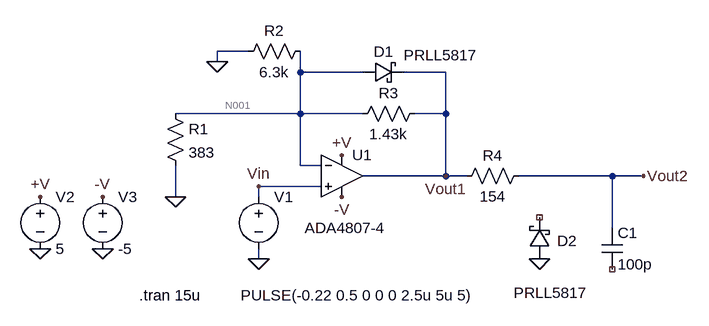
[diagram p0: schematic Draft9.asc]
Draft9.asc, the LTspice schematic file:
Version 4
SHEET 1 880 680
WIRE 32 -32 -16 -32
WIRE -16 -16 -16 -32
WIRE 112 0 112 -32
WIRE 208 0 112 0
WIRE 336 0 272 0
WIRE 112 64 112 0
WIRE 112 64 -80 64
WIRE 208 64 112 64
WIRE 336 64 336 0
WIRE 336 64 288 64
WIRE 112 144 112 64
WIRE 144 144 112 144
WIRE 336 160 336 64
WIRE 336 160 208 160
WIRE 368 160 336 160
WIRE 592 160 448 160
WIRE 640 160 592 160
WIRE 144 176 48 176
WIRE -80 192 -80 144
WIRE 48 192 48 176
WIRE 592 240 592 160
WIRE 48 288 48 272
FLAG -16 -16 0
FLAG 48 288 0
FLAG 176 128 +V
FLAG 176 192 -V
FLAG -288 192 +V
FLAG -192 192 -V
FLAG 480 288 0
FLAG 48 176 Vin
FLAG 336 160 Vout1
FLAG 640 160 Vout2
FLAG -80 192 0
FLAG -192 272 0
FLAG -288 272 0
SYMBOL OpAmps\\ADA4807-4 176 96 R0
WINDOW 3 -57 144 Left 2
SYMATTR InstName U1
SYMBOL res 128 -48 R90
WINDOW 0 0 56 VBottom 2
WINDOW 3 32 56 VTop 2
SYMATTR InstName R2
SYMATTR Value 6.3k
SYMBOL schottky 208 16 R270
WINDOW 0 32 32 VTop 2
WINDOW 3 58 120 VBottom 2
SYMATTR InstName D1
SYMATTR Value PRLL5817
SYMATTR Description Diode
SYMATTR Type diode
SYMBOL res 304 48 R90
WINDOW 0 0 56 VBottom 2
WINDOW 3 32 56 VTop 2
SYMATTR InstName R3
SYMATTR Value 1.43k
SYMBOL voltage 48 176 R0
WINDOW 123 0 0 Left 0
WINDOW 39 0 0 Left 0
WINDOW 3 -28 168 Left 2
SYMATTR Value PULSE(-0.22 0.5 0 0 0 2.5u 5u 5)
SYMATTR InstName V1
SYMBOL voltage -288 176 R0
SYMATTR InstName V2
SYMATTR Value 5
SYMBOL voltage -192 176 R0
SYMATTR InstName V3
SYMATTR Value -5
SYMBOL schottky 496 288 R180
WINDOW 0 -42 28 Left 2
WINDOW 3 -58 -52 Left 2
SYMATTR InstName D2
SYMATTR Value PRLL5817
SYMATTR Description Diode
SYMATTR Type diode
SYMBOL cap 576 240 R0
SYMATTR InstName C1
SYMATTR Value 100p
SYMBOL res -96 48 R0
SYMATTR InstName R1
SYMATTR Value 383
SYMBOL res 464 144 R90
WINDOW 0 0 56 VBottom 2
WINDOW 3 32 56 VTop 2
SYMATTR InstName R4
SYMATTR Value 154
TEXT -136 344 Left 2 !.tran 15u

The netlist it stands for:
* Draft9.asc
XU1 Vin N001 +V -V Vout1 ADA4807-4  ; pins In+ In- V+ V- OUT
R2 N001 0 6.3k
D1 N001 Vout1 PRLL5817
R3 Vout1 N001 1.43k
V1 Vin 0 PULSE(-0.22 0.5 0 0 0 2.5u 5u 5)
V2 +V 0 5
V3 -V 0 -5
D2 0 NC_01 PRLL5817
C1 Vout2 NC_02 100p
R1 N001 0 383
R4 Vout2 Vout1 154
.model D D
.lib standard.dio
.tran 15u
.backanno
.end

* Results of the author's LTspice run, read from the files saved beside the schematic
* Operating Point, zero values left out:
*   V(+v) = 5 V
*   V(-v) = -5 V
*   V(n001) = -220 mV
*   V(vin) = -220 mV
*   V(vout1) = -364.8 mV
*   V(vout2) = -364.8 mV
*   I(D1) = 509.2 µA
*   I(R1) = -574.4 µA
*   I(R3) = -101.2 µA
*   I(R2) = -34.92 µA
*   I(V3) = 1.647 mA
*   I(V2) = -1.039 mA
*   I(V1) = 1.106 µA
*   Ix(u1:1) = -1.106 µA
*   Ix(u1:2) = -1.106 µA
*   Ix(u1:3) = 1.039 mA
*   Ix(u1:4) = -1.647 mA
*   Ix(u1:5) = 610.4 µA
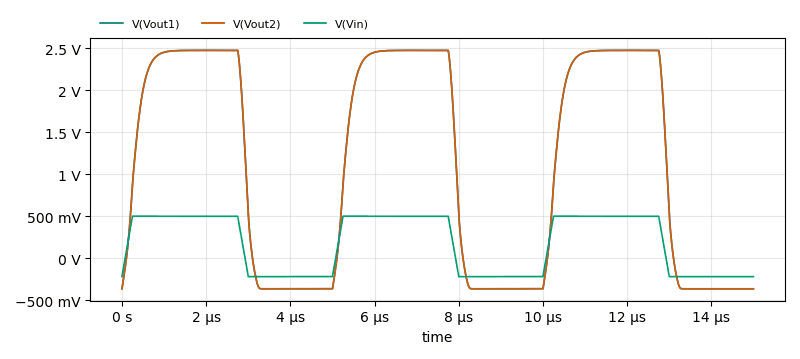
[diagram p1: Transient Analysis of Draft9.asc, plotted from the saved traces]
* Transient Analysis, 1 run:
*   V(Vout1): min -364.8 mV, max 2.476 V, average 1.134 V, rms 1.736 V, last -364.8 mV
*   V(Vout2): min -364.8 mV, max 2.476 V, average 1.134 V, rms 1.736 V, last -364.8 mV
*   V(Vin): min -220 mV, max 500 mV, average 176 mV, rms 388.2 mV, last -220 mV